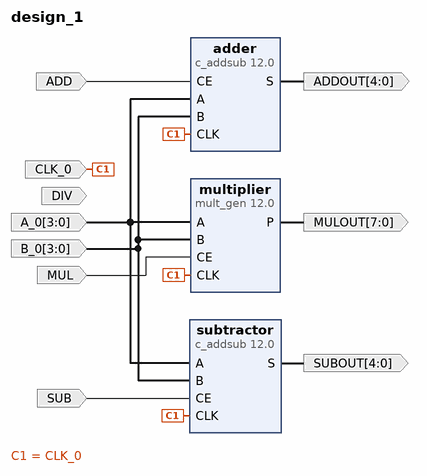
[diagram p0: block diagram of the top level]
# Vivado block design design_1, xc7a35tcpg236-1, Vivado 2018.3
create_bd_design design_1

create_bd_port -dir I -from 3 -to 0 -type data A_0
create_bd_port -dir I -from 3 -to 0 -type data B_0
create_bd_port -dir I -type ce ADD
create_bd_port -dir I -type clk CLK_0
create_bd_port -dir O -from 4 -to 0 -type data ADDOUT
create_bd_port -dir I SUB
create_bd_port -dir I MUL
create_bd_port -dir I DIV
create_bd_port -dir O -from 4 -to 0 -type data SUBOUT
create_bd_port -dir O -from 7 -to 0 MULOUT

create_bd_cell -type ip -vlnv xilinx.com:ip:c_addsub:12.0 adder
set_property -dict [list \
  CONFIG.A_Width 4 \
  CONFIG.B_Value 0000 \
  CONFIG.B_Width 4 \
  CONFIG.Implementation Fabric \
  CONFIG.Latency 1 \
  CONFIG.Out_Width 5 \
] [get_bd_cells adder]
create_bd_cell -type ip -vlnv xilinx.com:ip:c_addsub:12.0 subtractor
set_property -dict [list \
  CONFIG.A_Width 4 \
  CONFIG.B_Value 0000 \
  CONFIG.B_Width 4 \
  CONFIG.Implementation Fabric \
  CONFIG.Latency 1 \
  CONFIG.Out_Width 5 \
] [get_bd_cells subtractor]
create_bd_cell -type ip -vlnv xilinx.com:ip:mult_gen:12.0 multiplier
set_property -dict [list \
  CONFIG.ClockEnable true \
  CONFIG.MultType Parallel_Multiplier \
  CONFIG.PortAWidth 4 \
  CONFIG.PortBWidth 4 \
] [get_bd_cells multiplier]

# ---- connections ----

connect_bd_net -net CE_0_1 [get_bd_ports ADD] [get_bd_pins adder/CE]
connect_bd_net -net CLK_0_1 [get_bd_ports CLK_0] [get_bd_pins adder/CLK] [get_bd_pins multiplier/CLK] [get_bd_pins subtractor/CLK]
connect_bd_net -net c_addsub_0_S [get_bd_pins adder/S] [get_bd_ports ADDOUT]
connect_bd_net -net A_0_1 [get_bd_ports A_0] [get_bd_pins adder/A] [get_bd_pins subtractor/A] [get_bd_pins multiplier/A]
connect_bd_net -net B_0_1 [get_bd_ports B_0] [get_bd_pins adder/B] [get_bd_pins subtractor/B] [get_bd_pins multiplier/B]
connect_bd_net [get_bd_ports MUL] [get_bd_pins multiplier/CE]
connect_bd_net [get_bd_ports SUB] [get_bd_pins subtractor/CE]
connect_bd_net [get_bd_pins subtractor/S] [get_bd_ports SUBOUT]
connect_bd_net [get_bd_pins multiplier/P] [get_bd_ports MULOUT]

validate_bd_design
save_bd_design
